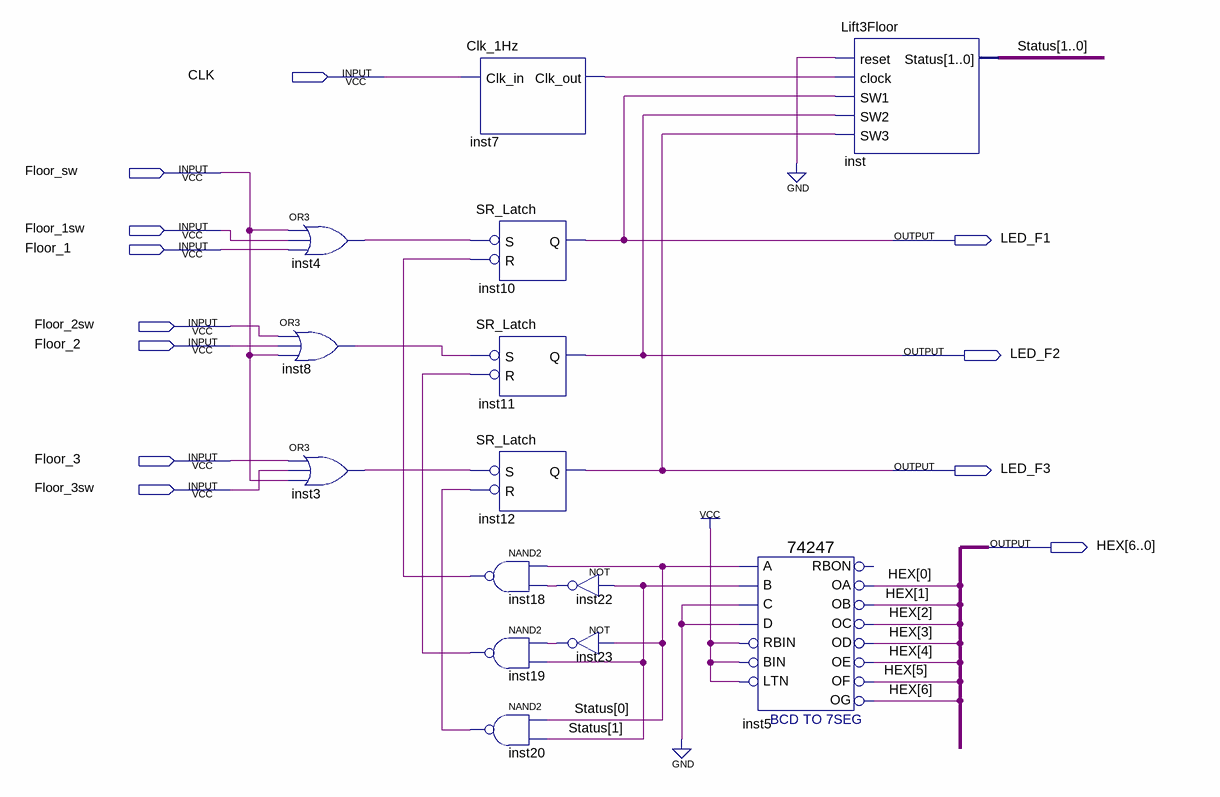
[diagram p0: schematic sheet]
// Quartus schematic Test_Lift.bdf as structural Verilog: 14 symbols, 12 pins
module Test_Lift (
  input  CLK,
  input  Floor_sw,
  input  Floor_1sw,
  input  Floor_1,
  input  Floor_2sw,
  input  Floor_2,
  input  Floor_3,
  input  Floor_3sw,
  output LED_F1,
  output LED_F2,
  output LED_F3,
  output [6:0] HEX
);

  wire inst3_out, inst4_out, inst7_clk_out, inst8_out, inst18_out, inst19_out, inst20_out, inst22_out,
       inst23_out;
  wire [1:0] Status;

  or inst4 (inst4_out, Floor_sw, Floor_1sw, Floor_1);
  or inst8 (inst8_out, Floor_2sw, Floor_2, Floor_sw);
  or inst3 (inst3_out, Floor_3, Floor_3sw, Floor_sw);
  Clk_1Hz inst7 (.Clk_in(CLK), .Clk_out(inst7_clk_out));
  SR_Latch inst10 (.S(inst4_out), .R(inst18_out), .Q(LED_F1));
  SR_Latch inst11 (.S(inst8_out), .R(inst19_out), .Q(LED_F2));
  SR_Latch inst12 (.S(inst3_out), .R(inst20_out), .Q(LED_F3));
  nand inst18 (inst18_out, Status[0], inst22_out);
  nand inst19 (inst19_out, inst23_out, Status[1]);
  nand inst20 (inst20_out, Status[0], Status[1]);
  not inst22 (inst22_out, Status[1]);
  not inst23 (inst23_out, Status[0]);
  \74247  inst5 (
    .LTN(1'b1), .BIN(1'b1), .A(Status[0]), .B(Status[1]), .RBIN(1'b1), .C(1'b0), .D(1'b0), .OF(HEX[5]),
    .OC(HEX[2]), .OD(HEX[3]), .OE(HEX[4]), .OA(HEX[0]), .OB(HEX[1]), .OG(HEX[6]));  // open: RBON
  Lift3Floor inst (.reset(1'b0), .clock(inst7_clk_out), .SW1(LED_F1), .SW2(LED_F2), .SW3(LED_F3), .Status(Status));
endmodule
